# EasyEDA Pro project esp8266开关.eprj, schematic Schematic2
Board Name: Board1; Create Date: 2025-05-15; Page Name: version 2.0; Project Name: esp8266开关; Schematic Name: Schematic2; Update Date: 2025-05-15; Company: 嘉立创EDA; Page Size: A4; Version: V1.0
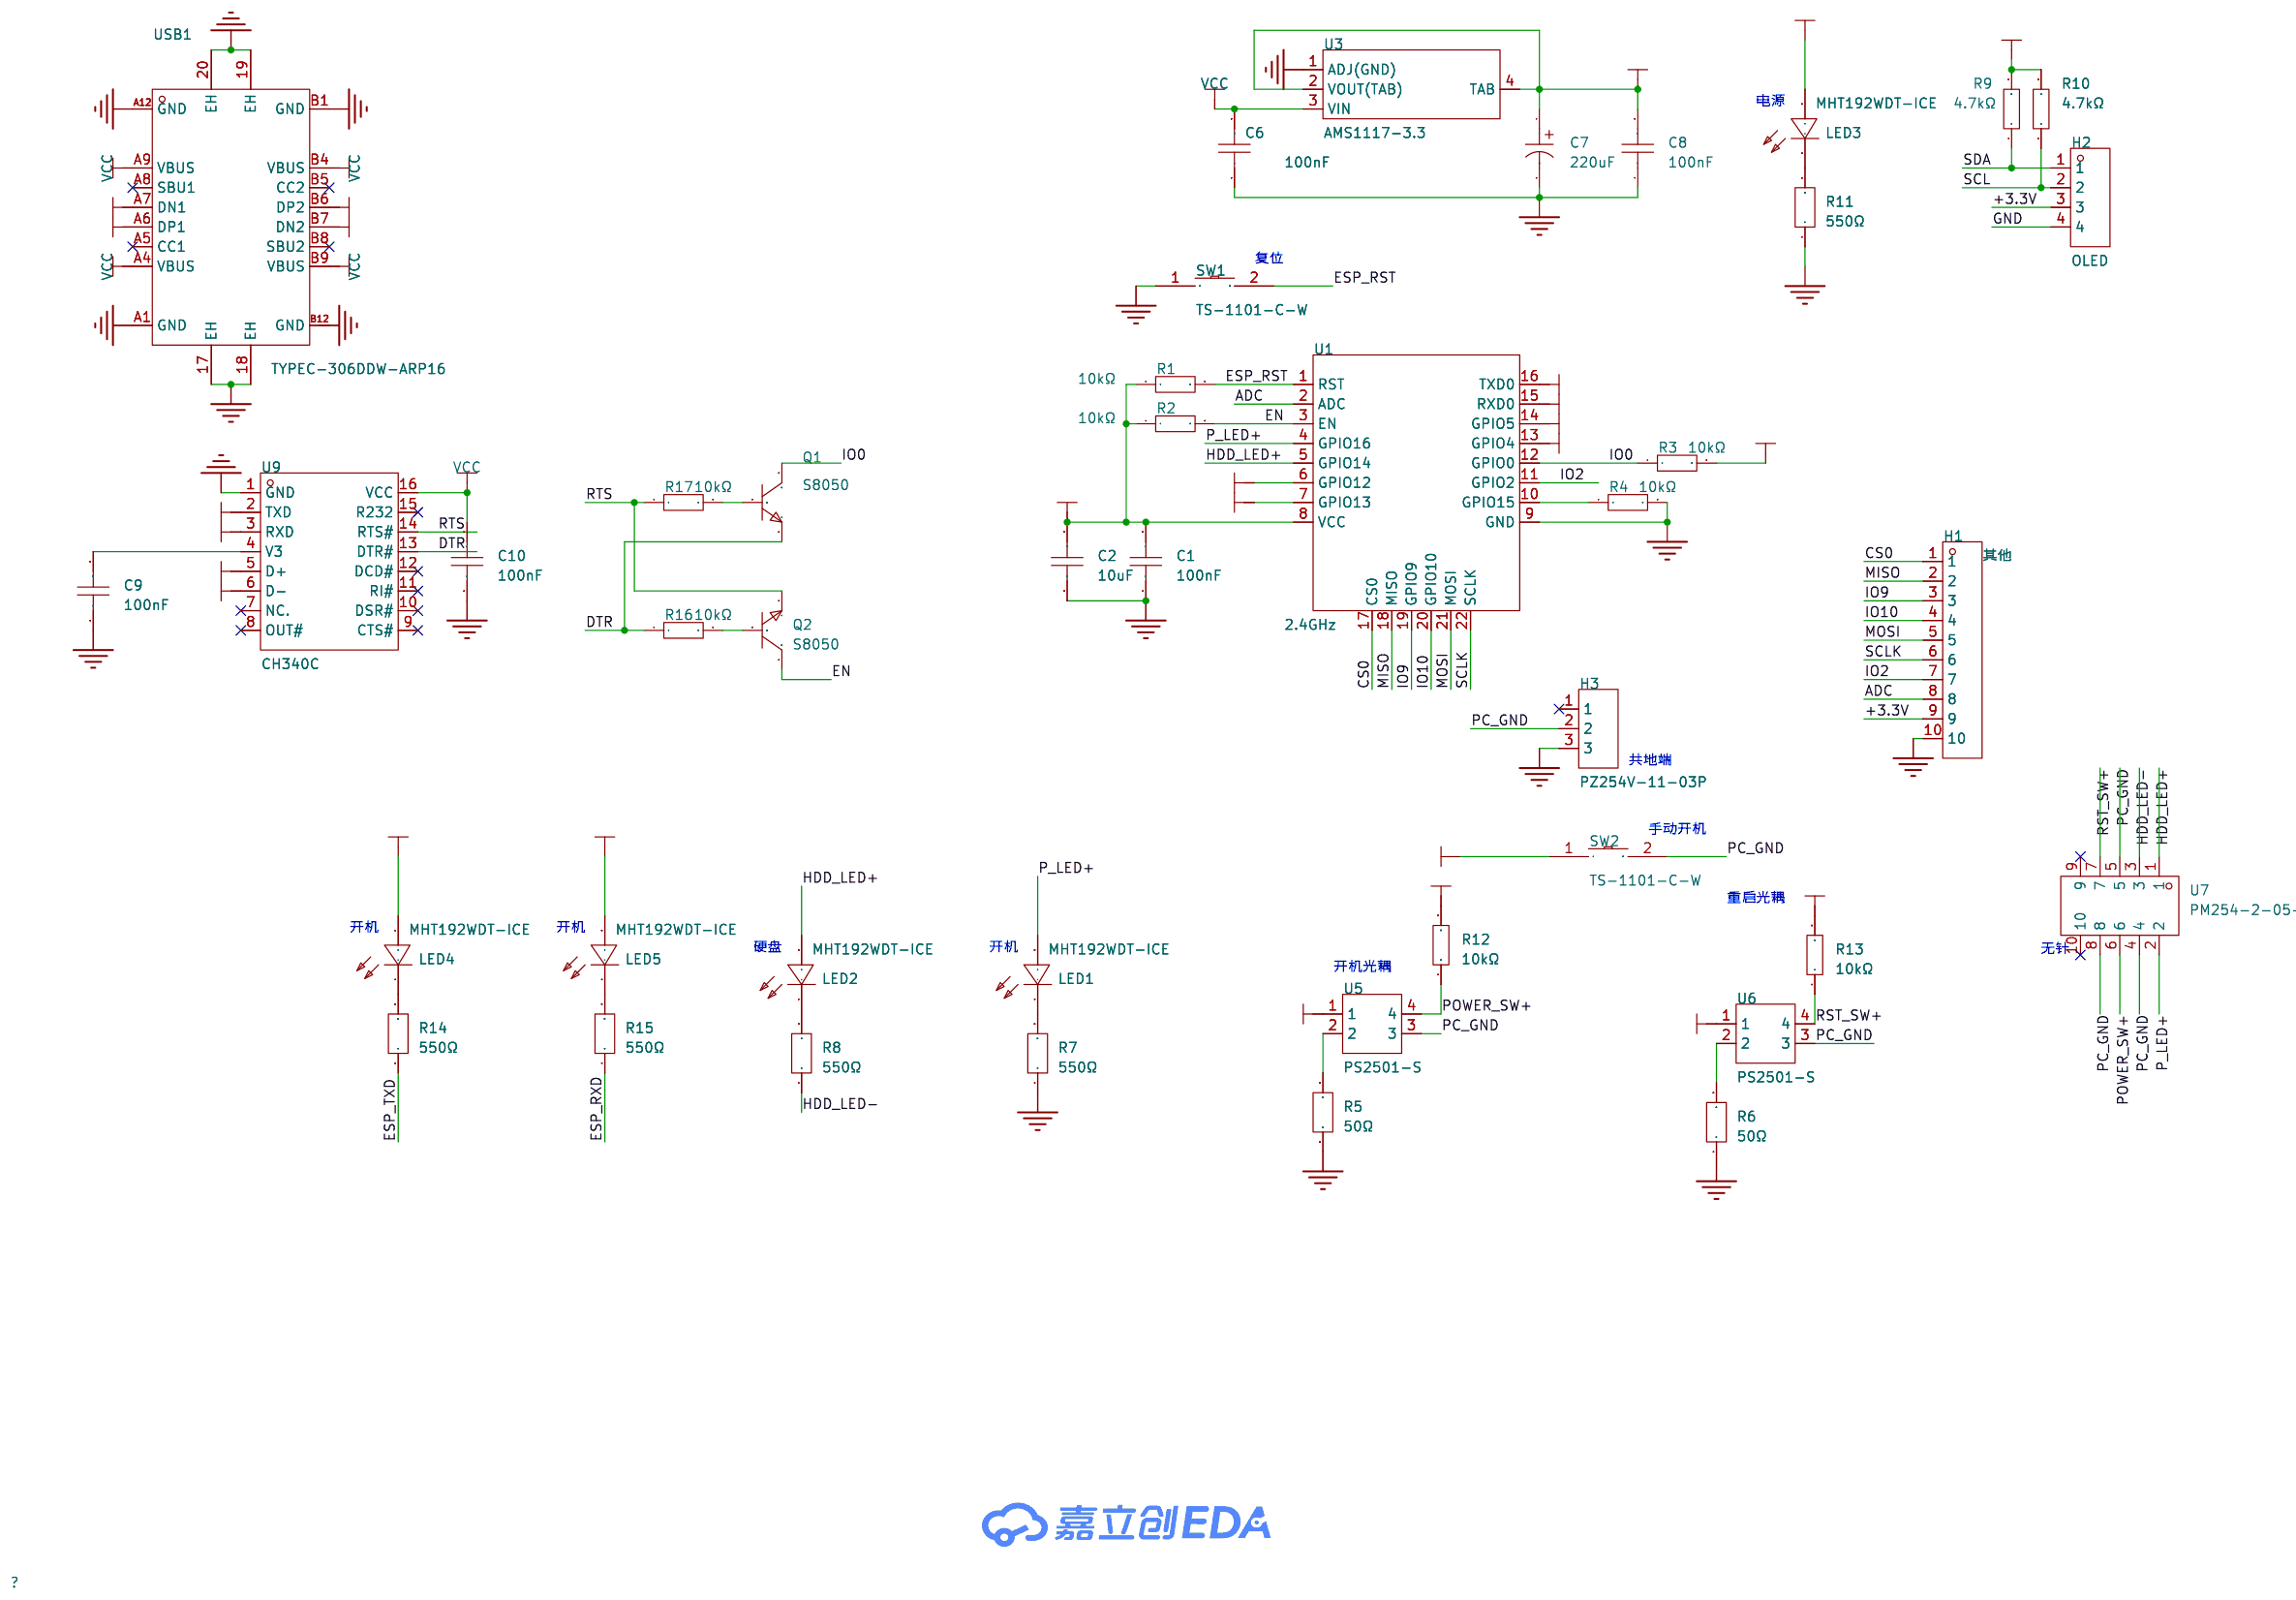
[diagram p1: schematic sheet]

## Parts
C1  100nF  [C0603]
C2  10uF  [C0603]
C6  100nF  [C0603]
C7  220uF  [CAP-SMD_BD6.3-L6.6-W6.6-FD]
C8  100nF  [C0603]
C9  100nF  [C0603]
C10  100nF  [C0603]
H1  其他  [HDR-TH_10P-P2.54-V-F]
H2  OLED  [HDR-TH_4P-P2.54-V-F]
H3  PZ254V-11-03P  [HDR-TH_3P-P2.54-V-M]
LED1  MHT192WDT-ICE  [LED0603-RD]
LED2  MHT192WDT-ICE  [LED0603-RD]
LED3  MHT192WDT-ICE  [LED0603-RD]
LED4  MHT192WDT-ICE  [LED0603-RD]
LED5  MHT192WDT-ICE  [LED0603-RD]
Q1  S8050  [SOT-23-3_L2.9-W1.3-P1.90-LS2.3-BR]
Q2  S8050  [SOT-23-3_L2.9-W1.3-P1.90-LS2.3-BR]
R1  10kΩ  [R0603]
R2  10kΩ  [R0603]
R3  10kΩ  [R0603]
R4  10kΩ  [R0603]
R5  50Ω  [R0603]
R6  50Ω  [R0603]
R7  550Ω  [R0603]
R8  550Ω  [R0603]
R9  4.7kΩ  [R0603]
R10  4.7kΩ  [R0603]
R11  550Ω  [R0603]
R12  10kΩ  [R0603]
R13  10kΩ  [R0603]
R14  550Ω  [R0603]
R15  550Ω  [R0603]
R16  10kΩ  [R0603]
R17  10kΩ  [R0603]
SW1  TS-1101-C-W  [SW-SMD_L6.0-W3.3-LS8.0]
SW2  TS-1101-C-W  [SW-SMD_L6.0-W3.3-LS8.0]
U1  2.4GHz  [WIFIM-SMD_ESP-12F-ESP8266MOD]
U3  AMS1117-3.3  [SOT-223-4_L6.5-W3.5-P2.30-LS7.0-BR]
U5  PS2501-S  [SMD-4_L5.5-W4.5-P2.54-LS10.0-TL]
U6  PS2501-S  [SMD-4_L5.5-W4.5-P2.54-LS10.0-TL]
U7  PM254-2-05-Z-8.5  [HDR-TH_10P-P2.54-V-F-R2-C5-S2.54]
U9  CH340C  [SOP-16_L10.0-W3.9-P1.27-LS6.0-BL]
USB1  TYPEC-306DDW-ARP16  [USB-C-TH_TYPEC-306DDW-ARP16]

## Library data of the parts
C1 C9 C10 = CGA0603X7R104K500JT: LCSC Part Name: 100nF ±10% 50V; Supplier Part: C6119867; Manufacturer: HRE(芯声); Supplier Footprint: 0603; JLCPCB Part Class: 扩展库; Datasheet: https://atta.szlcsc.com/upload/public/pdf/source/20250103/C44077DA9E7B3EFAE02F22B6D3D1CBC9.pdf; Supplier: LCSC; Tolerance: ±10%; Voltage Rating: 50V; Temperature Coefficient: X7R
C2 = CGA0603X5R106K100JT: LCSC Part Name: 10uF ±10% 10V; Supplier Part: C6119842; Manufacturer: HRE(芯声); Supplier Footprint: 0603; JLCPCB Part Class: 扩展库; Supplier: LCSC; Tolerance: ±10%; Voltage Rating: 10V; Temperature Coefficient: X5R
C6 C8 = CGA0603X7R104K500JT: LCSC Part Name: 100nF ±10% 50V; Supplier Part: C6119867; Manufacturer: HRE(芯声); Supplier Footprint: 0603; JLCPCB Part Class: 扩展库; Datasheet: https://atta.szlcsc.com/upload/public/pdf/source/20250103/C44077DA9E7B3EFAE02F22B6D3D1CBC9.pdf; Supplier: LCSC; Tolerance: ±10%; Voltage Rating: 50V; Temperature Coefficient: X7R; Voltage Rated: 50V; Check: true
C7 = RVT1A221M0605_C72494: 容值:220uF;精度:±20%;额定电压:10V;纹波电流:90mA@120Hz;等效串联电阻(ESR):-;; LCSC Part Name: 220uF ±20% 10V; Supplier Part: C72494; Manufacturer: ROQANG(容强); Manufacturer Part: RVT1A221M0605; Supplier Footprint: SMD,D6.3xL5.4mm; JLCPCB Part Class: Extended Part; Datasheet: https://atta.szlcsc.com/upload/public/pdf/source/20170325/1490427950282.pdf; Supplier: LCSC; Tolerance: ±20%; Voltage Rating: 10V; Ripple Current: 90mA@120Hz; Diameter: 6.3mm; Height - Seated (Max): 5.4mm; Lifetime: 2000hrs@105℃; Operating Temperature: -40℃~+105℃; Check: true
H1 = PM254-1-10-Z-8.5: LCSC Part Name: 1x10P 间距:2.54mm 直插; Supplier Part: C2897373; Manufacturer: HCTL(华灿天禄); Supplier Footprint: 插件,P=2.54mm; JLCPCB Part Class: 扩展库; Datasheet: https://atta.szlcsc.com/upload/public/pdf/source/20230609/534BE42964C679BDE98E061007C4ABD6.pdf; Supplier: LCSC; Holes Structure: 1x10P; Pitch: 2.54mm; Circular Hole / Square Hole: 方孔; Mounting Type: 直插; Number of Rows: 单排; Number of Holes: 10P; Current Rating (Max): 3A; Holes Direction: 顶部; Insulation Height: 8.5mm; Contact Material: 铜合金; Operating Temperature Range: -40℃~+105℃; Soldering Temperature(Max): 260℃@5S
H2 = 2.54-1*4P母: LCSC Part Name: 间距:2.54mm 1x4P 直插; Supplier Part: C2718488; Manufacturer: BOOMELE(博穆精密); Supplier Footprint: 插件,P=2.54mm; JLCPCB Part Class: 扩展库; Datasheet: https://atta.szlcsc.com/upload/public/pdf/source/20210301/C2718488_F4427B881E42CAA8DDB0B1C12B3A522C.pdf; Supplier: LCSC; Holes Structure: 1x4P; Pitch: 2.54mm; Circular Hole / Square Hole: 方孔; Mounting Type: 直插; Number of Rows: 单排; Number of Holes: 4P; Current Rating (Max): 3A; Holes Direction: 顶部; Contact Material: 青铜; Operating Temperature Range: -40℃~+105℃
H3 = PZ254V-11-03P: LCSC Part Name: 1x3P 间距:2.54mm 方针 直插; Supplier Part: C2937625; Manufacturer: XFCN(兴飞); Supplier Footprint: 插件,P=2.54mm; JLCPCB Part Class: 扩展库; Datasheet: https://atta.szlcsc.com/upload/public/pdf/source/20200309/C492402_8335C3D49C4E4C618838D59BB1D024C1.pdf; Supplier: LCSC; Pin Structure: 1x3P; Pitch: 2.54mm; Circluar Pins/Square Pins: 方针; Mounting Type: 直插; Number of Rows: 单排; Number of Pins: 3P; Current Rating: 3A; Voltage Rating (Max): 250V; Length of Mating Pin: 6mm; Insulation Height: 2.5mm; Length of End Connection Pin: 3mm; Operating Temperature: -40℃~+105℃; Color: 黑色
LED1-LED5 = MHT192WDT-ICE: LCSC Part Name: 蓝灯 冰蓝; Supplier Part: C389522; Manufacturer: MEIHUA(美华); Supplier Footprint: 0603; JLCPCB Part Class: 扩展库; Datasheet: https://atta.szlcsc.com/upload/public/pdf/source/20190515/C389522_27B43B3FF0A26A72E674F8300763D196.pdf; Supplier: LCSC; Emitted Color: 冰蓝色; Power Dissipation: 95mW; Forward Current: 5mA; Lens Color: 雾状黄透镜; Viewing Angle: 130°; Operating Temperature: -35℃~+85℃
Q1 Q2 = S8050_C20069125: LCSC Part Name: hFE:200-350，丝印:J3Y S8050; Supplier Part: C20069125; Manufacturer: 宏嘉诚; Supplier Footprint: SOT-23; JLCPCB Part Class: 扩展库; Datasheet: https://atta.szlcsc.com/upload/public/pdf/source/20250107/343E8B94B5C24D0D65D7D4B70E0B73F6.pdf; Supplier: LCSC; type: NPN; Current - Collector(Ic): 500mA; Collector - Emitter Voltage VCEO: 25V; Pd - Power Dissipation: 300mW; DC Current Gain: 120@50mA,1.0V; Transition frequency(fT): 100MHz; Current - Collector Cutoff: 100nA; Vce Saturation(VCE(sat)): 600mV; Operating Temperature: -55℃~+150℃
R1-R4 R12 R13 R16 R17 = 0603WAF1002T5E: LCSC Part Name: 厚膜电阻 10kΩ ±1% 100mW; Supplier Part: C25804; Manufacturer: UNI-ROYAL(厚声); Supplier Footprint: 0603; JLCPCB Part Class: 基础库; Datasheet: https://atta.szlcsc.com/upload/public/pdf/source/20200306/C422600_1E6D84923E4A46A82E41ADD87F860B5C.pdf; Supplier: LCSC; Type: 厚膜电阻; Tolerance: ±1%; Power(Watts): 100mW; Overload Voltage (Max): 75V; Temperature Coefficient: ±100ppm/℃; Operating Temperature Range: -55℃~+155℃
R5-R8 R11 R14 R15 = RT0603BRE0750RL: LCSC Part Name: 薄膜电阻 50Ω ±0.1% 100mW; Supplier Part: C849792; Manufacturer: YAGEO(国巨); Supplier Footprint: 0603; JLCPCB Part Class: 扩展库; Datasheet: https://atta.szlcsc.com/upload/public/pdf/source/20200610/C326738_5639A9F1B6EB6E4AE2197577D3456E7F.pdf; Supplier: LCSC; Type: 薄膜电阻; Tolerance: ±0.1%; Power(Watts): 100mW; Temperature Coefficient: ±50ppm/℃; Operating Temperature Range: -55℃~+155℃
R9 R10 = 0603WAF4701T5E: LCSC Part Name: 4.7kΩ ±1% 100mW 厚膜电阻; Supplier Part: C23162; Manufacturer: UNI-ROYAL(厚声); Supplier Footprint: 0603; JLCPCB Part Class: 基础库; Datasheet: https://atta.szlcsc.com/upload/public/pdf/source/20200306/C422600_1E6D84923E4A46A82E41ADD87F860B5C.pdf; Supplier: LCSC; Type: 厚膜电阻; Tolerance: ±1%; Power(Watts): 100mW; Overload Voltage (Max): 75V; Temperature Coefficient: ±100ppm/℃; Operating Temperature Range: -55℃~+155℃
SW1 SW2 = TS-1101-C-W: LCSC Part Name: 6*3.6*2.5mm 立贴 轻触开关; Supplier Part: C318938; Manufacturer: XKB Connectivity(中国星坤); Supplier Footprint: SMD; JLCPCB Part Class: 扩展库; Datasheet: https://atta.szlcsc.com/upload/public/pdf/source/20200227/C318938_C2E53B1EEDE37D980A33616AC086DE53.pdf; Supplier: LCSC; Circuit: 单刀单掷; Actuator Style: 矩形按钮; Operating Force: 260gf; Mounting Style: 立贴; Switch Length: 6mm; Switch Width: 3.6mm; Switch Height: 2.5mm; Strike Gundam: 不带; Contact Current: 50mA; Voltage Rating (DC): 12V; Actuator/Cap Color: 白色带淡绿; With Lamp: 无; Mechanical Life: 5万次; Operating Temperature: -30℃~+85℃
U1 = ESP-12F(ESP8266MOD): LCSC Part Name: 完整的802.11b/g/nWi-FiSoC模块 屏蔽罩上的丝印是：ESP8266MOD，ESP8266EX串口WIFI; Supplier Part: C82891; Manufacturer: Ai-Thinker(安信可); Supplier Footprint: SMD,16x24mm; JLCPCB Part Class: 扩展库; Datasheet: https://atta.szlcsc.com/upload/public/pdf/source/20210219/C82891_ABD84A460F4F056A2757267CCCA4B508.pdf; Supplier: LCSC; Core Processor: ESP8266芯片; Support Interface: GPIO；UART；I2C；PWM；SPI；ADC; Antenna Type: 板载PCB天线; Output Power: 16dBm; Operating Voltage: 3.3V; Receive  Current: 120mA; Send  Current: 170mA; Sensitivity: -90dBm; Operating Temperature: -40℃~+85℃
U3 = AMS1117-3.3_C347222: LCSC Part Name: 输出:3.3V 电流:1A 耐压:12V; Supplier Part: C347222; Manufacturer: UMW(友台半导体); Supplier Footprint: SOT-223; JLCPCB Part Class: Extended Part; Datasheet: https://atta.szlcsc.com/upload/public/pdf/source/20241218/BAF0263FA2E44BCD8AF41AA4FA04EFAA.pdf; Supplier: LCSC; Output Type: 固定; Voltage - Supply: 12V; Output Voltage: 3.3V; Output Current: 1A; Power Supply Rejection Ratio (PSRR): 60dB@(120Hz); Voltage Dropout: 1.3V@(1A); Features: 过流保护; Output Configuration: 正极; Number of Outputs: 1; Check: true
U5 U6 = PS2501-S: LCSC Part Name: DC输入 隔离电压(rms):5000V; Supplier Part: C364145; Manufacturer: UMW(友台半导体); Supplier Footprint: SOP-4; JLCPCB Part Class: Extended Part; Datasheet: https://atta.szlcsc.com/upload/public/pdf/source/20211011/572CEF9A47A90BDDCE3838A85995DFE3.pdf; Supplier: LCSC; Output Type: 光电三极管; Voltage - Forward(Vf): 1.17V; Output Current: 50mA; Isolation Voltage(Vrms): 5kV; Reverse Voltage: 6V; Load Voltage: 80V; Number of Outputs: 1; Vce Saturation(VCE(sat)): 300mV@10mA,2mA; Rise time: 3us; Fall time: 5us; Operating Temperature: -55℃~+100℃; Current Transfer Ratio (CTR) Minimum: 80%; Current Transfer Ratio (CTR) Maximum/Saturation Value: 600%
U7 = PM254-2-05-Z-8.5: LCSC Part Name: 2x5P 间距:2.54mm 直插; Supplier Part: C2897406; Manufacturer: HCTL(华灿天禄); Supplier Footprint: 插件,P=2.54mm; JLCPCB Part Class: 扩展库; Datasheet: https://atta.szlcsc.com/upload/public/pdf/source/20230609/3D36CA2C1BFC9FD1C3F709AD9DFEB9C2.pdf; Supplier: LCSC; Holes Structure: 2x5P; Pitch: 2.54mm; Row Spacing: 2.54mm; Circular Hole / Square Hole: 方孔; Mounting Type: 直插; Number of Rows: 双排; Number of Holes: 10P; Current Rating (Max): 3A; Holes Direction: 顶部; Insulation Height: 8.5mm; Contact Material: 铜合金; Operating Temperature Range: -40℃~+105℃; Soldering Temperature(Max): 260℃@5S
U9 = CH340C: Supplier Part: C84681; Manufacturer: WCH(南京沁恒); Supplier Footprint: SOP-16; JLCPCB Part Class: 扩展库; Datasheet: https://atta.szlcsc.com/upload/public/pdf/source/20240619/63986D8440D4E5267A77ACD891CC4DE3.pdf; Supplier: LCSC; Applications Function: 收发器; Protocol: USB 2.0; Voltage - Supply: 3.3V；5V; Data Rate: 2Mbps
USB1 = TYPEC-306DDW-ARP16: LCSC Part Name: Type-C 母 弯插; Supplier Part: C2840393; Manufacturer: XUNPU(讯普); Supplier Footprint: 插件; JLCPCB Part Class: 扩展库; Datasheet: https://atta.szlcsc.com/upload/public/pdf/source/20210817/197D5097245422051F6928F5184DB483.pdf; Supplier: LCSC; Connector Type: Type-C; Standard: USB 3.1; Gender: 母; Number of Ports: 1; Number of Contacts: 16P; Mounting Style: 弯插; Current Rating - Power (Max): 5A; Operating Temperature Range: -45℃~+85℃; Soldering Temperature(Max): 260℃

## Nets
+3.3V: C1.2 C2.2 C7.1 C8.2 H1.9 H2.3 LED3.2(+) LED4.2(+) LED5.2(+) R1.1 R2.1 R3.2 R9.2 R10.2 R12.2 R13.2 U1.8(VCC) U3.2(VOUT(TAB)) U3.4(TAB)
GND: C1.1 C2.1 C6.1 C7.2 C8.1 C9.1 C10.1 H1.10 H2.4 H3.3 R4.2 R5.1 R6.1 R7.1 R11.1 SW1.1 U1.9(GND) U3.1(ADJ(GND)) U9.1(GND) USB1.17(EH) USB1.18(EH) USB1.19(EH) USB1.20(EH) USB1.A1(GND) USB1.A12(GND) USB1.B1(GND) USB1.B12(GND)
VCC: C6.2 C10.2 U3.3(VIN) U9.16(VCC) USB1.A4(VBUS) USB1.A9(VBUS) USB1.B4(VBUS) USB1.B9(VBUS)
ADC: H1.8 U1.2(ADC)
CS0: H1.1 U1.17(CS0)
D+: U9.5(D+) USB1.A6(DP1) USB1.B6(DP2)
D-: U9.6(D-) USB1.A7(DN1) USB1.B7(DN2)
DTR: Q1.2(E) R16.1 U9.13(DTR#)
EN: Q2.3(C) R2.2 U1.3(EN)
ESP_RST: R1.2 SW1.2 U1.1(RST)
ESP_RXD: R15.1 U1.15(RXD0) U9.2(TXD)
ESP_TXD: R14.1 U1.16(TXD0) U9.3(RXD)
HDD_LED+: LED2.2(+) U1.5(GPIO14) U7.1
HDD_LED-: R8.1 U7.3
IO0: Q1.3(C) R3.1 U1.12(GPIO0)
IO2: H1.7 U1.11(GPIO2)
IO9: H1.3 U1.19(GPIO9)
IO10: H1.4 U1.20(GPIO10)
MISO: H1.2 U1.18(MISO)
MOSI: H1.5 U1.21(MOSI)
P_LED+: LED1.2(+) U1.4(GPIO16) U7.2
PC_GND: H3.2 SW2.2 U5.3 U6.3 U7.4 U7.5 U7.8
PC_PWR: U1.6(GPIO12) U5.1
PC_RST: U1.7(GPIO13) U6.1
POWER_SW+: R12.1 SW2.1 U5.4 U7.6
RST_SW+: R13.1 U6.4 U7.7
RTS: Q2.2(E) R17.1 U9.14(RTS#)
SCL: H2.2 R10.1 U1.13(GPIO4)
SCLK: H1.6 U1.22(SCLK)
SDA: H2.1 R9.1 U1.14(GPIO5)
$1N2533: R4.1 U1.10(GPIO15)
$1N2537: R5.2 U5.2
$1N2541: R6.2 U6.2
$1N2565: LED1.1(-) R7.2
$1N2573: LED2.1(-) R8.2
$1N2635: LED3.1(-) R11.2
$1N2653: LED4.1(-) R14.2
$1N2655: LED5.1(-) R15.2
$1N3077: C9.2 U9.4(V3)
$1N3432: Q1.1(B) R17.2
$1N3436: Q2.1(B) R16.2

Not connected (* = marked no-connect by the designer): H3 1*; U7 9* 10*; U9 7(NC.)* 8(OUT#)* 9(CTS#)* 10(DSR#)* 11(RI#)* 12(DCD#)* 15(R232)*; USB1 A5(CC1)* A8(SBU1)* B5(CC2)* B8(SBU2)*

## Notes on the sheet
- 电源
- 复位
- 共地端
- 手动开机
- 重启光耦
- 开机
- 开机
- 无针
- 硬盘
- 开机
- 开机光耦
